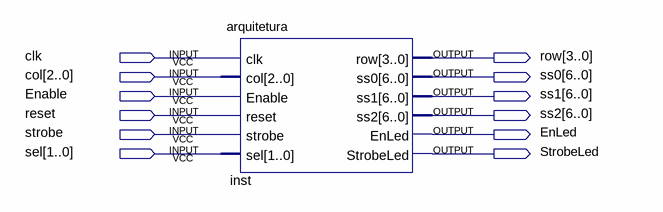
[diagram p0: schematic sheet]
// Quartus schematic testArquitetura.bdf as structural Verilog: 1 symbols, 12 pins
module testArquitetura (
  input  clk,
  input  [2:0] col,
  input  Enable,
  input  reset,
  input  strobe,
  input  [1:0] sel,
  output [3:0] row,
  output [6:0] ss0,
  output [6:0] ss1,
  output [6:0] ss2,
  output EnLed,
  output StrobeLed
);

  arquitetura inst (
    .clk(clk), .col(col), .Enable(Enable), .reset(reset), .strobe(strobe), .sel(sel), .row(row), .ss0(ss0),
    .ss1(ss1), .ss2(ss2), .EnLed(EnLed), .StrobeLed(StrobeLed));
endmodule
